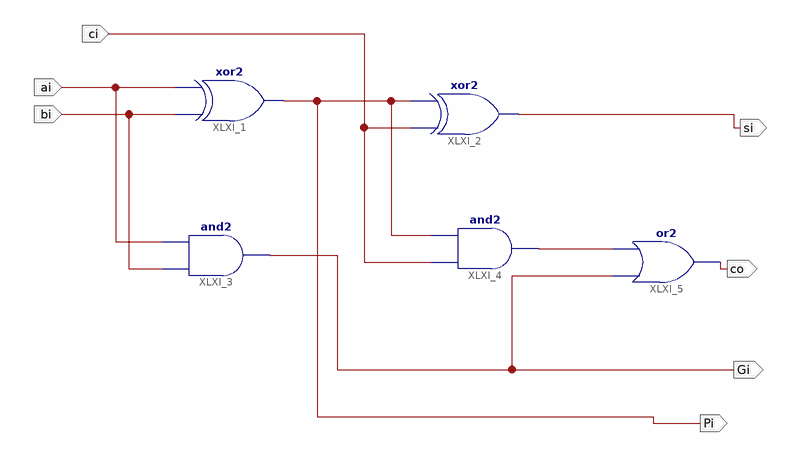
[diagram p0: schematic sheet 1]
// Xilinx ISE schematic add_sch.sch (kintex7) as structural Verilog: 5 symbols, 7 ports
module add_sch (
  input  bi,
  input  ai,
  input  ci,
  output Pi,
  output Gi,
  output si,
  output co
);

  wire XLXN_15;

  xor XLXI_1 (Pi, bi, ai);
  xor XLXI_2 (si, ci, Pi);
  and XLXI_3 (Gi, bi, ai);
  and XLXI_4 (XLXN_15, ci, Pi);
  or XLXI_5 (co, Gi, XLXN_15);
endmodule
